# Altium schematic sheet Communications.SchDoc
size 420 x 297 mm
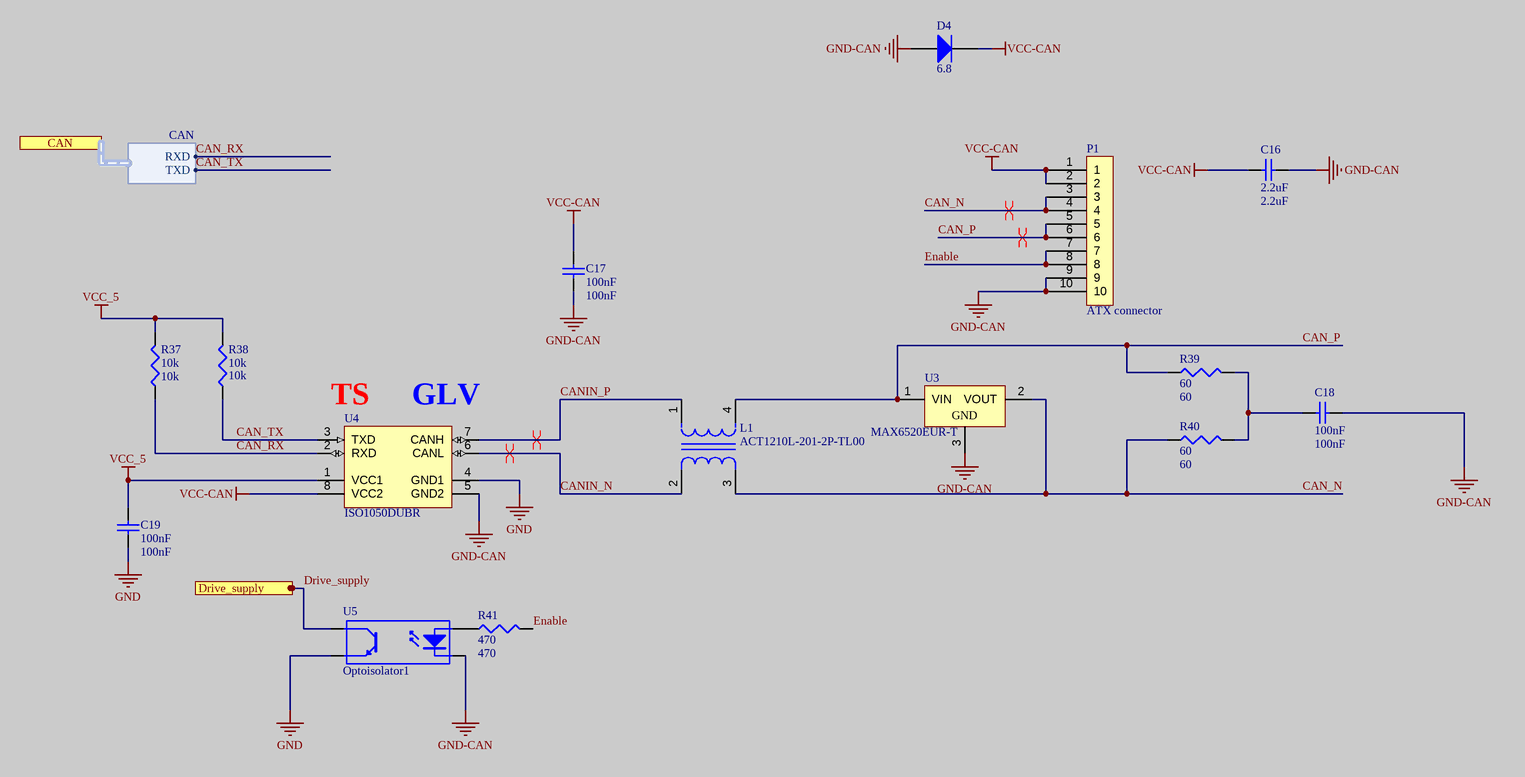
[diagram p0: Communications.SchDoc]

## Parts
C16  2.2uF  [C0805]
C17  100nF  [C0805]
C18  100nF  [C0805]
C19  100nF  [C0805]
D4  6.8  [DIOD-SOD123-2_V]
L1  ACT1210L-201-2P-TL00  [FP-ACT1210L-MFG]
P1  ATX connector  [ATX 10pin]
R37  10k  [R0805]
R38  10k  [R0805]
R39  60  [R0805]
R40  60  [R0805]
R41  470  [R0805]
U3  MAX6520EUR-T  [SOT23-3_N]
U4  ISO1050DUBR  [DUB0008A_M]
U5  Optoisolator1  [DIP-4]

## Ports
CAN (harness CAN), Drive_supply

## Harnesses
CAN: RXD, TXD

## Nets
GND: C19.2 U4.4(GND1) U5.3(E)
GND-CAN: C16.2 C17.1 C18.1 D4.1(A) P1.9 P1.10 U3.3(GND) U4.5(GND2) U5.2(K)
VCC-CAN: C16.1 C17.2 D4.2(K) P1.1 P1.2 U4.8(VCC2)
VCC_5: C19.1 R37.2 R38.2 U4.1(VCC1)
CAN_N: L1.3 P1.3 P1.4 R40.1 U3.2(VOUT)
CAN_P: L1.4 P1.5 P1.6 R39.1 U3.1(VIN)
CAN_RX: R37.1 U4.2(RXD) ; port CAN.RXD
CAN_TX: R38.1 U4.3(TXD) ; port CAN.TXD
CANIN_N: L1.2 U4.6(CANL)
CANIN_P: L1.1 U4.7(CANH)
Drive_supply: U5.4(C) ; port Drive_supply
Enable: P1.7 P1.8 R41.2
NetC18_2: C18.2 R39.2 R40.2
NetR41_1: R41.1 U5.1(A)

## Layout directives
differential pair: CAN_N, CAN_P, CANIN_N, CANIN_P

## Notes on the sheet
- (near U4) TS
- (near U4) GLV
- THIS DOCUMENT AND THE DATA DISCLOSED HEREIN OR
- HEREWITH IS THE PROPERTY OF ALTIUM LIMITED AND MAY
- DWG NO:
- REVISION
- REV:
- DESCRIPTION
- DATE
- APPROVED
- BE FREELY DISTRIBUTED IN WHOLE. NO RIGHTS ARE
- RESERVED OR EXPRESS OR IMPLIED WARANTEE GIVEN.
- ENG:
- APPROVALS
- PROJECT
- DSN:
- CHK:
- REFERENCE DOCUMENTS
- PROJECT REVISION:
- TITLE
- DOCUMENT REVISION:
- DESIGN ITEM:
- BOM:
- FAB DWG:
- PCB DWG:
- ASSY DWG:
- SCALE:
- A3
- SIZE
- CAGE CODE
- FILE NAME
- DWG NO.
- SHEET
- OF
- REV

## Library data of the parts
C16-C19 = Capacitor: Published: 8-Jun-2000; LatestRevisionDate: 29-May-2009; LatestRevisionNote: IPC-7351 Footprint Added.; PackageReference: C1206; Publisher: Altium Limited; PackageDescription: Chip Capacitor
  C16: Value: 2.2uF
  C17-C19: Value: 100nF
D4 = CMP-2000-04932-2: Fast Switching Diode, 100 V, 0.15 A, -65 to 150 degC, 2-Pin?SOD123, RoHS, Tape and Reel; Recovery Time: 4ns; Brand: DiodesIncorporated; Unit Weight: 0.000353oz; Max Surge Current: 2A; Peak Reverse Voltage: 100V; Ir - Reverse Current: 1uA; Vf - Forward Voltage: 1.25V; Configuration: Single; If - Forward Current: 0.15A; Product Category: Diodes-GeneralPurpose,Power,Switching; Operating Temperature Range: -65Cto+150C; Packaging: Reel; Manufacturer URL: http://www.diodes.com/; Maximum Operating Temperature: +150C; Height: 1.25mm; Minimum Operating Temperature: -65C; Product: SwitchingDiodes; Package URL: http://www.diodes.com/datasheets/ds18004.pdf; Type: SwitchingDiode; Package Reference: SOD123-2; Width: 1.7mm; Datasheet URL: http://www.farnell.com/datasheets/1915529.pdf; Datasheet Version: Rev. 24-2, 10/2013; Series: 1N4148; Factory Pack Quantity: 3000; Length: 2.85mm; RoHS: True; Manufacturer: DiodesIncorporated; Mounting Style: SMD/SMT; Package / Case: SOD-123
L1 = CMP-08256-000003-1: CMC 200UH 70MA 2LN SMD; Manufacturer: TDK; Test Frequency: 100kHz; Series Resistance: 5.5Ω; Impedance At Frequency: 9.5kΩ @ 10MHz; Tolerance: -10/30%; Automotive Grade: Grade 1; Automotive: Yes; ComponentLink2URL: https://product.tdk.com/info/en/catalog/datasheets/cmf_automotive_signal_act1210l-201_en.pdf; Height: 2.5mm; RoHS: TRUE; Rms Current: 70mA; Temperature Range High: +125°C; Composition: Wirewound; Device Class L1: Passive Components; Device Class L3: Common Mode Chokes; Value: 200uH; Category: Ind; Mouser Description: Ind Common Mode Choke 200uH 9.5KOhm 70mA 5.5Ohm -10% to 30% Wirewound 4-Pin 1210; Device Class L2: EMI / RFI Components; Temperature Range Low: -40°C; Package: ACT1210L; Digikey Description: CMC 200UH 70MA 2LN SMD; Octopart: https://octopart.com/act1210l-201-2p-tl00-tdk-81014617; Manufacturer Part Number: ACT1210L-201-2P-TL00; Lead Free: Yes; Inductance: 200uH; Temperature: -40°C to +125°C; ComponentLink2Description: Datasheet
R37-R41 = Resistor: Published: 8-Jun-2000; LatestRevisionDate: 29-May-2009; LatestRevisionNote: IPC-7351 Footprint Added.; PackageReference: J1-0603; Publisher: Altium Limited; PackageDescription: Chip Resistor
  R37 R38: Value: 10k
  R39 R40: Value: 60
  R41: Value: 470
U3 = MAX6520EUR-T: 3-Terminal, 1.2V Voltage Reference; Published: 16-Jan-2001; LatestRevisionDate: 29-May-2009; LatestRevisionNote: IPC-7351 Footprint Added.; DatasheetVersion: Sep-1996; PackageVersion: 1996; PackageReference: SOT23-3; Publisher: Altium Limited; PackageDescription: 3-Pin SOT-23 Package 0.95 mm Pitch, 2.3 mm Lead Span; ComponentLink1Description: Manufacturer Link; ComponentLink1URL: http://www.maxim-ic.com/; ComponentLink2Description: Datasheet; ComponentLink2URL: http://pdfserv.maxim-ic.com/en/ds/MAX6520.pdf
U4 = CMP-0315-00093-2: Isolated CAN Transceiver, -55 to 105 degC, 8-pin SOP (DUB), Green (RoHS & no Sb/Br); Manufacturer: Texas Instruments; Rating: Catalog; Isolated: Yes; Drivers Per Package: 1; PackageReference: DUB0008A; PartNumber: ISO1050DUBR; ComponentLink2Description: Package Specification; ComponentLink1Description: Datasheet; Mounting Technology: Surface Mount; ComponentLink1URL: http://www.ti.com/general/docs/lit/getliterature.tsp?genericPartNumber=ISO1050&fileType=pdf; ComponentLink2URL: http://www.ti.com/litv/pdf/mpds247b; Eco-Plan: Green (RoHS & no Sb/Br); PackageDescription: 8-Pin Small Outline Package 2.54 mm Pitch; PackageVersion: revC, May-2006; SubFamily: CAN; DatasheetVersion: SLLS983E
U5 = Optoisolator1: 4-Pin Phototransistor Optocoupler; Published: 24-Mar-1999; LatestRevisionDate: 04-Mar-2005; LatestRevisionNote: Sch pins 3 & 4 Swapped.; DatasheetVersion: Nov-2003; PackageReference: DIP-4; Publisher: Altium Limited